# Altium schematic sheet Sheet1.SchDoc
size A3; Organization: Altium Limited; Address1: L3, 12a Rodborough Rd; Address2: Frenchs Forest; Address3: NSW; Address4: Australia 2086; SheetNumber: 1; SheetTotal: 6
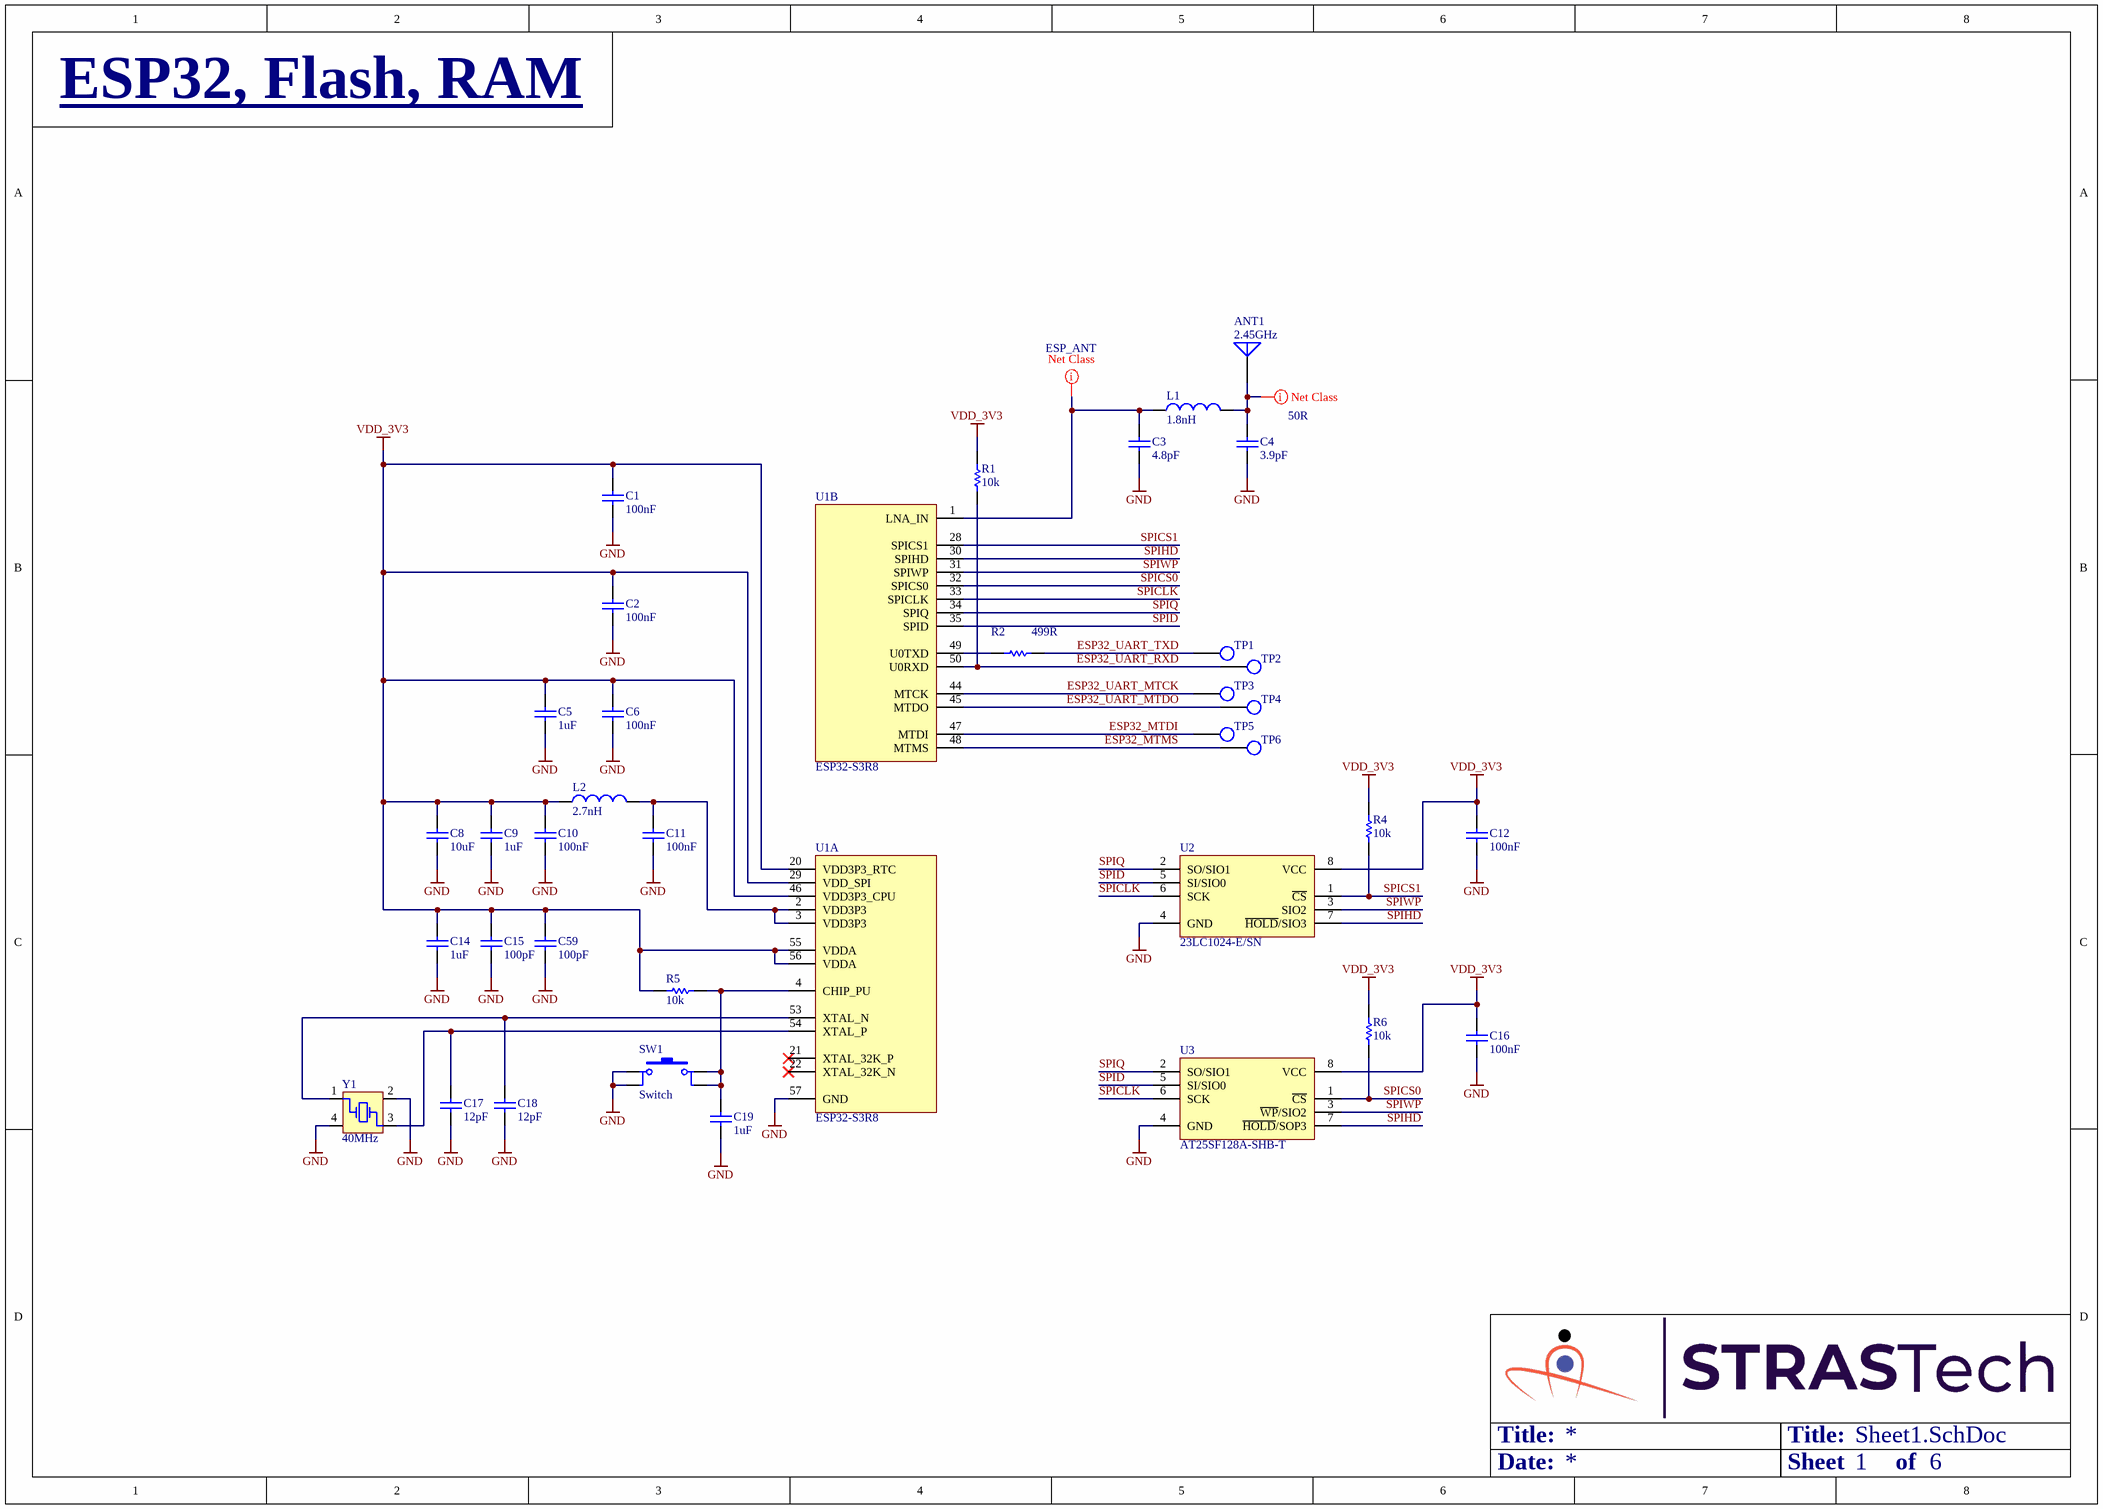
[diagram p0: Sheet1.SchDoc]

## Parts
ANT1  2.45GHz  [ANT,PCB,IFA,2.45GHZ]
C1  100nF  [Cap,SMD,0402]
C2  100nF  [Cap,SMD,0402]
C3  4.8pF  [Cap,SMD,0402]
C4  3.9pF  [Cap,SMD,0402]
C5  1uF  [Cap,SMD,0402]
C6  100nF  [Cap,SMD,0402]
C8  10uF  [Cap,SMD,0402]
C9  1uF  [Cap,SMD,0402]
C10  100nF  [Cap,SMD,0402]
C11  100nF  [Cap,SMD,0402]
C12  100nF  [Cap,SMD,0402]
C14  1uF  [Cap,SMD,0402]
C15  100pF  [Cap,SMD,0402]
C16  100nF  [Cap,SMD,0402]
C17  12pF  [Cap,SMD,0402]
C18  12pF  [Cap,SMD,0402]
C19  1uF  [Cap,SMD,0402]
C59  100pF  [Cap,SMD,0402]
L1  1.8nH  [ind,0402]
L2  2.7nH  [ind,0402]
R1  10k  [RES,0402]
R2  499R  [RES,0402]
R4  10k  [RES,0402]
R5  10k  [RES,0402]
R6  10k  [RES,0402]
SW1  Switch  [Switch,Tactile,Micro,SPST-NO,SMD]
TP1  TESTPOINT  [testpoint,smd,round,1mm]  (value not drawn)
TP2  TESTPOINT  [testpoint,smd,round,1mm]  (value not drawn)
TP3  TESTPOINT  [testpoint,smd,round,1mm]  (value not drawn)
TP4  TESTPOINT  [testpoint,smd,round,1mm]  (value not drawn)
TP5  TESTPOINT  [testpoint,smd,round,1mm]  (value not drawn)
TP6  TESTPOINT  [testpoint,smd,round,1mm]  (value not drawn)
U1  ESP32-S3R8  [IC,QFN-56,7X7,P0.4MM]  (parts A,B of 3)
U2  23LC1024-E/SN  [IC,SOIC-8,1.27mm,W3.9]
U3  AT25SF128A-SHB-T  [IC,SOIC-8,1.27mm,W3.9]
Y1  40MHz  [XTAL,SMD,4 Pin,2x2.5mm]

## Nets
GND: C1.1 C2.1 C3.1 C4.1 C5.1 C6.1 C8.1 C9.1 C10.1 C11.1 C12.1 C14.1 C15.1 C16.1 C17.2 C18.2 C19.1 C59.1 SW1.1 SW1.2 U1.57(GND) U2.4(GND) U3.4(GND) Y1.2(GND) Y1.4(GND)
VDD_3V3: C1.2 C2.2 C5.2 C6.2 C8.2 C9.2 C10.2 C12.2 C14.2 C15.2 C16.2 C59.2 L2.1 R1.2 R4.2 R5.2 R6.2 U1.20(VDD3P3_RTC) U1.29(VDD_SPI) U1.46(VDD3P3_CPU) U1.55(VDDA) U1.56(VDDA) U2.8(VCC) U3.8(VCC)
ESP32_MTDI: TP5.1(TP) U1.47(MTDI)
ESP32_MTMS: TP6.1(TP) U1.48(MTMS)
ESP32_UART_MTCK: TP3.1(TP) U1.44(MTCK)
ESP32_UART_MTDO: TP4.1(TP) U1.45(MTDO)
ESP32_UART_RXD: R1.1 TP2.1(TP) U1.50(U0RXD)
ESP32_UART_TXD: R2.2 TP1.1(TP)
SPICLK: U1.33(SPICLK) U2.6(SCK) U3.6(SCK)
SPICS0: R6.1 U1.32(SPICS0) U3.1(~{CS})
SPICS1: R4.1 U1.28(SPICS1) U2.1(~{CS})
SPID: U1.35(SPID) U2.5(SI/SIO0) U3.5(SI/SIO0)
SPIHD: U1.30(SPIHD) U2.7(~{HOLD}/SIO3) U3.7(~{HOLD}/SOP3)
SPIQ: U1.34(SPIQ) U2.2(SO/SIO1) U3.2(SO/SIO1)
SPIWP: U1.31(SPIWP) U2.3(SIO2) U3.3(~{WP}/SIO2)
NetANT1_1: ANT1.1 C4.2 L1.2
NetC3_2: C3.2 L1.1 U1.1(LNA_IN)
NetC11_2: C11.2 L2.2 U1.2(VDD3P3) U1.3(VDD3P3)
NetC17_1: C17.1 U1.54(XTAL_P) Y1.3(OSC2)
NetC18_1: C18.1 U1.53(XTAL_N) Y1.1(OSC1)
NetC19_2: C19.2 R5.1 SW1.3 SW1.4 U1.4(CHIP_PU)
NetR2_1: R2.1 U1.49(U0TXD)

Not connected (* = marked no-connect by the designer): U1 21(XTAL_32K_P)* 22(XTAL_32K_N)*

## Layout directives
net class ESP_ANT: NetC3_2
net class 50R: NetANT1_1

## Notes on the sheet
- ESP32, Flash, RAM
- Title:
- Date:
- Sheet
- of
- Title
- Size:
- A3
- Revision:
- Design By:

## Library data of the parts
ANT1 = ANT,2.45GHz,IFA,PCB: 2.4-GHz Inverted F Antenna; HelpURL: https://www.ti.com/lit/an/swru120d/swru120d.pdf?ts=1646240772720&ref_url=https%253A%252F%252Fwww.google.com%252F; CreatedBy: Judd Foster; Manufacturer: N/A; Manufacturer Part Number: N/A; Vendor: N/A; Vendor Part Number: N/A
C1 C2 C6 C10-C12 C16 = CAP,Cer,100nF,25VDC,X7R,0402: 0.1µF ±10% 25V Ceramic Capacitor X7R 0402 (1005 Metric); Vendor Part Number: 490-14603-1-ND; Manufacturer: Murata Electronics; Manufacturer Part Number: GRM155R71E104KE14J; Vendor: Digikey; HelpURL: https://search.murata.co.jp/Ceramy/image/img/A01X/G101/ENG/GRM155R71E104KE14-01.pdf; CreatedBy: Judd Foster
C3 = CAP,Cer,4.8pF,50VDC,C0G/NP0,0402: 4.8 pF ±0.25pF 50V Ceramic Capacitor C0G, NP0 0402 (1005 Metric); Vendor Part Number: 490-17481-1-ND; Manufacturer: Murata Electronics; Manufacturer Part Number: GCQ1555C1H4R8CB01D; Vendor: Digikey; HelpURL: https://search.murata.co.jp/Ceramy/image/img/A01X/G101/ENG/GCQ1555C1H4R8CB01-01.pdf; CreatedBy: Judd Foster
C4 = CAP,Cer,3.9pF,50VDC,C0G/NP0,0402: 3.9 pF ±0.1pF 50V Ceramic Capacitor C0G, NP0 0402 (1005 Metric); Vendor Part Number: 399-CBR04C399B5GACCT-ND; Manufacturer: KEMET; Manufacturer Part Number: CBR04C399B5GAC; Vendor: Digikey; HelpURL: https://api.kemet.com/component-edge/download/datasheet/CBR04C399B5GAC.pdf; CreatedBy: Judd Foster
C5 C9 C14 = CAP,Cer,1uF,35VDC,X5R,0402: 1 µF ±10% 35V Ceramic Capacitor X5R 0402 (1005 Metric); Vendor Part Number: 445-9073-1-ND; Manufacturer: TDK Corporation; Manufacturer Part Number: C1005X5R1V105K050BC; Vendor: Digikey; HelpURL: https://product.tdk.com/info/en/catalog/datasheets/mlcc_commercial_general_en.pdf?ref_disty=digikey; CreatedBy: Judd Foster
C8 = CAP,Cer,10uF,10VDC,X5R,0402: 10 µF ±20% 10V Ceramic Capacitor X5R 0402 (1005 Metric); Vendor Part Number: 1276-1450-1-ND; Manufacturer: Samsung Electro-Mechanics; Manufacturer Part Number: CL05A106MP5NUNC; Vendor: Digikey; HelpURL: https://media.digikey.com/pdf/Data%20Sheets/Samsung%20PDFs/CL05A106MP5NUNC_Spec.pdf; CreatedBy: Judd Foster
C15 C59 = CAP,Cer,100pF,50VDC,C0G/NP0,0402: 100pF ±5% 50V Ceramic Capacitor C0G, NP0 0402 (1005 Metric); Vendor Part Number: 490-10669-1-ND; Manufacturer: Murata Electronics; Manufacturer Part Number: GCM1555C1H101JA16D; Vendor: Digikey; HelpURL: https://www.murata.com/~/media/webrenewal/support/library/catalog/products/capacitor/mlcc/c03e.ashx?la=en-us; CreatedBy: Judd Foster
C17 C18 = CAP,Cer,12pF,50VDC,C0G/NP0,0402: 12pF ±5% 50V Ceramic Capacitor C0G, NP0 0402 (1005 Metric); Vendor Part Number: 311-1016-1-ND; Manufacturer: Yageo; Manufacturer Part Number: CC0402JRNPO9BN120; Vendor: Digikey; HelpURL: https://www.yageo.com/upload/media/product/productsearch/datasheet/mlcc/UPY-GP_NP0_16V-to-50V_18.pdf; CreatedBy: Judd Foster
C19 = CAP,Cer,1uF,6.3VDC,X5R,0402: 1µF ±20% 6.3V Ceramic Capacitor X5R 0402 (1005 Metric); Vendor Part Number: 1276-1235-1-ND; Manufacturer: Samsung Electro-Mechanics; Manufacturer Part Number: CL05A105MQ5NNNC; Vendor: Digikey; HelpURL: https://media.digikey.com/pdf/Data%20Sheets/Samsung%20PDFs/CL_Series_MLCC_ds.pdf; CreatedBy: Judd Foster
L1 = IND,1.8nH,900mA,Multilayer,0402: 1.8 nH Unshielded Multilayer Inductor 900 mA 100mOhm Max 0402 (1005 Metric); Vendor Part Number: 490-1076-1-ND; Manufacturer: Murata Electronics; Manufacturer Part Number: LQG15HN1N8S02D; Vendor: Digikey; HelpURL: https://search.murata.co.jp/Ceramy/image/img/P02/JELF243B-0009.pdf; CreatedBy: Judd Foster
L2 = IND,2.7nH,800mA,Multilayer,0402: 2.7nH Unshielded Multilayer Inductor 800mA 150mOhm Max 0402 (1005 Metric); Vendor Part Number: 490-2615-1-ND; Manufacturer: Murata Electronics; Manufacturer Part Number: LQG15HS2N7S02D; Vendor: Digikey; HelpURL: https://psearch.en.murata.com/inductor/product/LQG15HS2N7S02_.pdf; CreatedBy: Judd Foster
R1 R4-R6 = RES,10k,5%,0.063W,0402: 10 kOhms ±5% 0.063W, 1/16W Chip Resistor 0402 (1005 Metric) Automotive AEC-Q200 Thick Film; Vendor Part Number: RMCF0402JT10K0CT-ND; Manufacturer: Stackpole Electronics Inc; Manufacturer Part Number: RMCF0402JT10K0; Vendor: DIgikey; HelpURL: https://www.seielect.com/catalog/sei-rmcf_rmcp.pdf; CreatedBy: Judd Foster
R2 = RES,499R,1%,0.063W,0402: 499 Ohms ±1% 0.063W, 1/16W Chip Resistor 0402 (1005 Metric) Automotive AEC-Q200 Thick Film; Manufacturer: Stackpole Electronics Inc; Manufacturer Part Number: RMCF0402FT499R; Vendor Part Number: RMCF0402FT499RCT-ND; Vendor: Digikey; CreatedBy: Judd Foster; HelpURL: https://www.seielect.com/catalog/sei-rmcf_rmcp.pdf
SW1 = Switch,Tactile,SPST-NO,SMD,H1.5: Tactile Switch SPST-NO Top Actuated Surface Mount; Manufacturer: C&K; Manufacturer Part Number: PTS525SM15SMTR2 LFS; Vendor Part Number: CKN9104CT-ND; Vendor: Digikey; CreatedBy: Judd Foster; HelpURL: https://www.ckswitches.com/media/1467/pts525.pdf
TP1-TP6 = TESTPOINT: PCB Testpoint; CreatedBy: Judd Foster; HelpURL: N/A; Manufacturer: N/A; Manufacturer Part Number: N/A; Vendor: N/A; Vendor Part Number: N/A
U1 = ESP32-S3R8: IC RF TxRx + MCU Bluetooth, WiFi 802.11b/g/n, Bluetooth v5.0 2.412GHz ~ 2.484GHz 56-VFQFN Exposed Pad; Manufacturer: Espressif Systems; Vendor Part Number: 1904-ESP32-S3R8-ND; Vendor: Digikey; CreatedBy: Judd Foster; HelpURL: https://www.espressif.com/sites/default/files/documentation/esp32-s3_datasheet_en.pdf; Manufacturer Part Number: ESP32-S3R8
U2 = 23LC1024-E/SN: SRAM Memory IC 1Mb (128K x 8) SPI - Quad I/O 16 MHz 8-SOIC; Manufacturer: Microchip Technology; Vendor Part Number: 23LC1024-E/SN-ND; Vendor: Digikey; CreatedBy: Judd Foster; HelpURL: https://ww1.microchip.com/downloads/en/DeviceDoc/20005142C.pdf; Manufacturer Part Number: 23LC1024-E/SN
U3 = AT25SF128A-SHB-T: FLASH - NOR Memory IC 128Mb (16M x 8) SPI - Quad I/O 133 MHz 8-SOIC; Manufacturer: Adesto Technologies; Vendor Part Number: 1265-1348-1-ND; Vendor: Digikey; CreatedBy: Judd Foster; HelpURL: https://www.dialog-semiconductor.com/sites/default/files/2021-02/DS-AT25SF128A-168.pdf; Manufacturer Part Number: AT25SF128A-SHB-T
Y1 = XTAL,40MHz,12pF,SMD: 40 MHz ±7ppm Crystal 12pF 25 Ohms 4-SMD, No Lead; Manufacturer: Hosonic Electronic Co., Ltd; Manufacturer Part Number: E2SB40E000104E; Vendor Part Number: 3186-E2SB40E000104ECT-ND; Vendor: Digikey; CreatedBy: Judd Foster; HelpURL: https://ecsxtal.com/store/pdf/ECS-33B.pdf